# Altium schematic sheet EEPROM&FLASH.SchDoc
size 101 x 101 mm
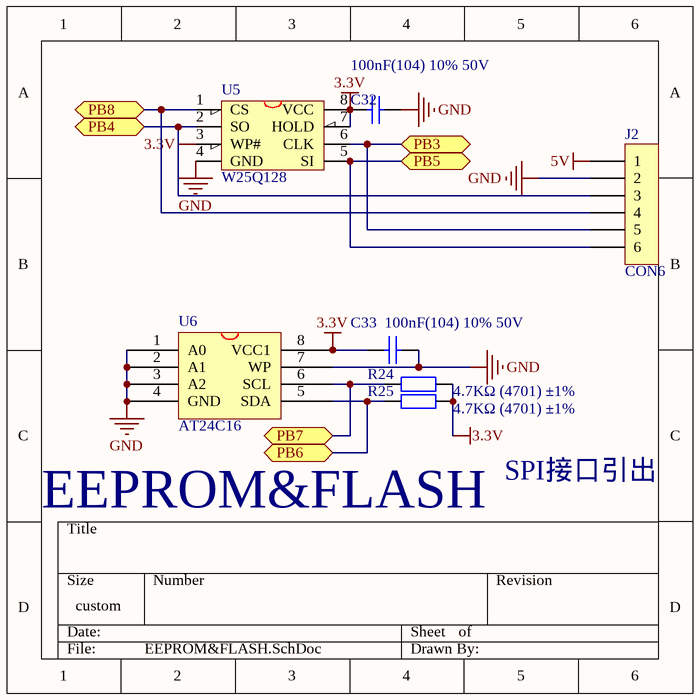
[diagram p0: EEPROM&FLASH.SchDoc]

## Parts
C32  100nF(104) 10% 50V  [0805_C]
C33  100nF(104) 10% 50V  [0805_C]
J2  CON6  [XH2.54-6P]
R24  4.7KΩ (4701) ±1%  [0805_R]
R25  4.7KΩ (4701) ±1%  [0805_R]
U5  W25Q128  [SOIC-8]
U6  AT24C16  [SOP-8]

## Ports
PB3, PB4, PB5, PB6, PB7, PB8

## Nets
3.3V: C32.1 C33.1 R24.2 R25.2 U5.3(WP#) U5.7(HOLD) U5.8(VCC) U6.8(VCC1)
5V: J2.1
GND: C32.2 C33.2 J2.2 U5.4(GND) U6.1(A0) U6.2(A1) U6.3(A2) U6.4(GND) U6.7(WP)
PB3: J2.5 U5.6(CLK) ; port PB3
PB4: J2.3 U5.2(SO) ; port PB4
PB5: J2.6 U5.5(SI) ; port PB5
PB6: R25.1 U6.5(SDA) ; port PB6
PB7: R24.1 U6.6(SCL) ; port PB7
PB8: J2.4 U5.1(CS) ; port PB8

## Notes on the sheet
- EEPROM&FLASH
- SPI接口引出

## Library data of the parts
C32 C33 = 0805 100nF(104) 10% 50V: 贴片电容; ComponentLink1Description: 供应商链接; ComponentLink1URL: http://www.szlcsc.com/product/details_50686.html; Package: 0805; Supplier: LC; SuppliersPartNumber: C49678
J2 = CON6: 连接器
R24 R25 = 0805 4.7KΩ (4701) 1%: 贴片电阻; ComponentLink1Description: 供应商链接; ComponentLink1URL: http://www.szlcsc.com/product/details_18361.html; Package: 0805; Supplier: LC; SuppliersPartNumber: C17673
U5 = W25X16: W25X16;SST25VF016;MX25L1605
U6 = 24C256